# Altium schematic sheet Gateway - Particle Boron LTE Shield.SchDoc: Gateway - Particle Boron LTE Shield
size A4; DrawnBy: Sawyer Rempel; Revision: B; SheetNumber: 1; SheetTotal: 1
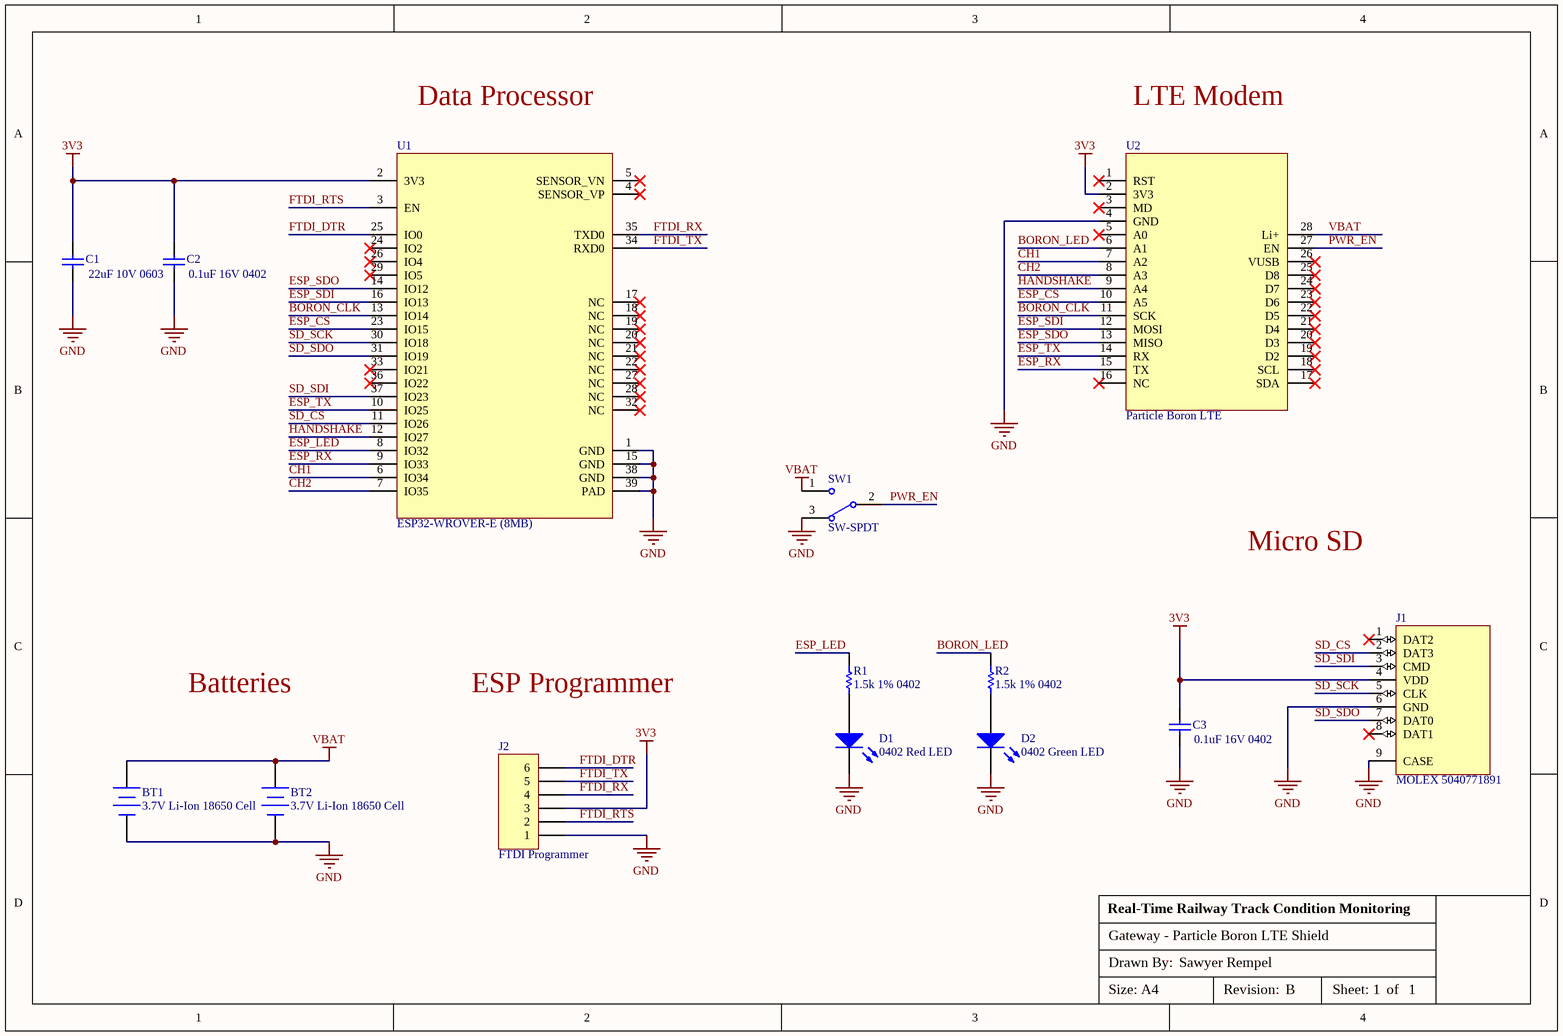
[diagram p0: Gateway - Particle Boron LTE Shield.SchDoc]

## Parts
BT1  3.7V Li-Ion 18650 Cell  [18650 Battery Clip]
BT2  3.7V Li-Ion 18650 Cell  [18650 Battery Clip]
C1  22uF 10V 0603  [0603 CAP]
C2  0.1uF 16V 0402  [0402 CAP]
C3  0.1uF 16V 0402  [0402 CAP]
D1  0402 Red LED  [GREEN 0402 LED]
D2  0402 Green LED  [GREEN 0402 LED]
J1  MOLEX 5040771891  [MOLEX 5040771891]
J2  FTDI Programmer  [PPTC061LFBN-RC]
R1  1.5k 1% 0402  [0402 RES]
R2  1.5k 1% 0402  [0402 RES]
SW1  SW-SPDT  [EG1218]
U1  ESP32-WROVER-E (8MB)  [ESP32-WROVER-E (8MB)]
U2  Particle Boron LTE  [Particle Boron LTE]

## Nets
3V3: C1.1 C2.1 C3.1 J1.4(VDD) J2.3 U1.2(3V3) U2.2(3V3)
GND: BT1.2(-) BT2.2(-) C1.2 C2.2 C3.2 D1.2(K) D2.2(K) J1.6(GND) J1.9(CASE) J2.1 SW1.3 U1.1(GND) U1.15(GND) U1.38(GND) U1.39(PAD) U2.4(GND)
VBAT: BT1.1(+) BT2.1(+) SW1.1 U2.28(Li+)
BORON_CLK: U1.13(IO14) U2.11(SCK)
BORON_LED: R2.2 U2.6(A1)
CH1: U1.6(IO34) U2.7(A2)
CH2: U1.7(IO35) U2.8(A3)
ESP_CS: U1.23(IO15) U2.10(A5)
ESP_LED: R1.2 U1.8(IO32)
ESP_RX: U1.9(IO33) U2.15(TX)
ESP_SDI: U1.16(IO13) U2.12(MOSI)
ESP_SDO: U1.14(IO12) U2.13(MISO)
ESP_TX: U1.10(IO25) U2.14(RX)
FTDI_DTR: J2.6 U1.25(IO0)
FTDI_RTS: J2.2 U1.3(EN)
FTDI_RX: J2.4 U1.35(TXD0)
FTDI_TX: J2.5 U1.34(RXD0)
HANDSHAKE: U1.12(IO27) U2.9(A4)
PWR_EN: SW1.2 U2.27(EN)
SD_CS: J1.2(DAT3) U1.11(IO26)
SD_SCK: J1.5(CLK) U1.30(IO18)
SD_SDI: J1.3(CMD) U1.37(IO23)
SD_SDO: J1.7(DAT0) U1.31(IO19)
NetD1_1: D1.1(A) R1.1
NetD2_1: D2.1(A) R2.1

Not connected (* = marked no-connect by the designer): J1 1(DAT2)* 8(DAT1)*; U1 4(SENSOR_VP)* 5(SENSOR_VN)* 17(NC)* 18(NC)* 19(NC)* 20(NC)* 21(NC)* 22(NC)* 24(IO2)* 26(IO4)* 27(NC)* 28(NC)* 29(IO5)* 32(NC)* 33(IO21)* 36(IO22)*; U2 1(RST)* 3(MD)* 5(A0)* 16(NC)* 17(SDA)* 18(SCL)* 19(D2)* 20(D3)* 21(D4)* 22(D5)* 23(D6)* 24(D7)* 25(D8)* 26(VUSB)*

## Notes on the sheet
- Data Processor
- LTE Modem
- Micro SD
- Batteries
- ESP Programmer
- Real-Time Railway Track Condition Monitoring
- Drawn By:
- Size: A4
- Revision:
- Sheet:     of

## Library data of the parts
BT1 BT2 = Battery: Multicell Battery
C1-C3 = Cap: Capacitor
  C1: Value: 22uF; Supplier Part Number: 490-10476-1-ND
  C2 C3: Value: 0.1uF; Supplier Part Number: 490-5415-2-ND
D1 D2 = LED0
  D1: Digikey PN: 754-1104-1-ND
  D2: Digikey PN: 754-1101-1-ND
J2 = Header 6: Header, 6-Pin; Supplier PN: S7004-ND
R1 R2 = Res1: Resistor; Digikey PN: 311-1.50KLRCT-ND
SW1 = SW-SPDT: SPDT Subminiature Toggle Switch, Right Angle Mounting, Vertical Actuation; Published: 24-Mar-1999; LatestRevisionDate: 17-Dec-2003; LatestRevisionNote: Schematic revised, PCB Footprint replaced.; DatasheetVersion: 05-Dec-2000; PackageReference: TL36WW15050; Publisher: Altium Limited; PackageDescription: Switch; 4 Leads; ComponentLink1Description: Manufacturer Link; ComponentLink1URL: http://www.apem.com